# Altium schematic sheet Moo_AFE.SchDoc
size 317 x 215 mm; PageSetup: Record=PageOptions|CenterHorizontal=True|CenterVertical=True|PrintScale=0.57|XCorrection=0.00|YCorrection=1.00|PrintKind=2|BorderSize=5000000|LeftOffset=0|BottomOffset=0|Orientation=2|PaperLength=1000|PaperWidth=1000|Scale=100|PaperSource=15|PrintQuality=1200|MediaType=1|DitherType=10|PaperKind=Letter|PrintScaleMode=1
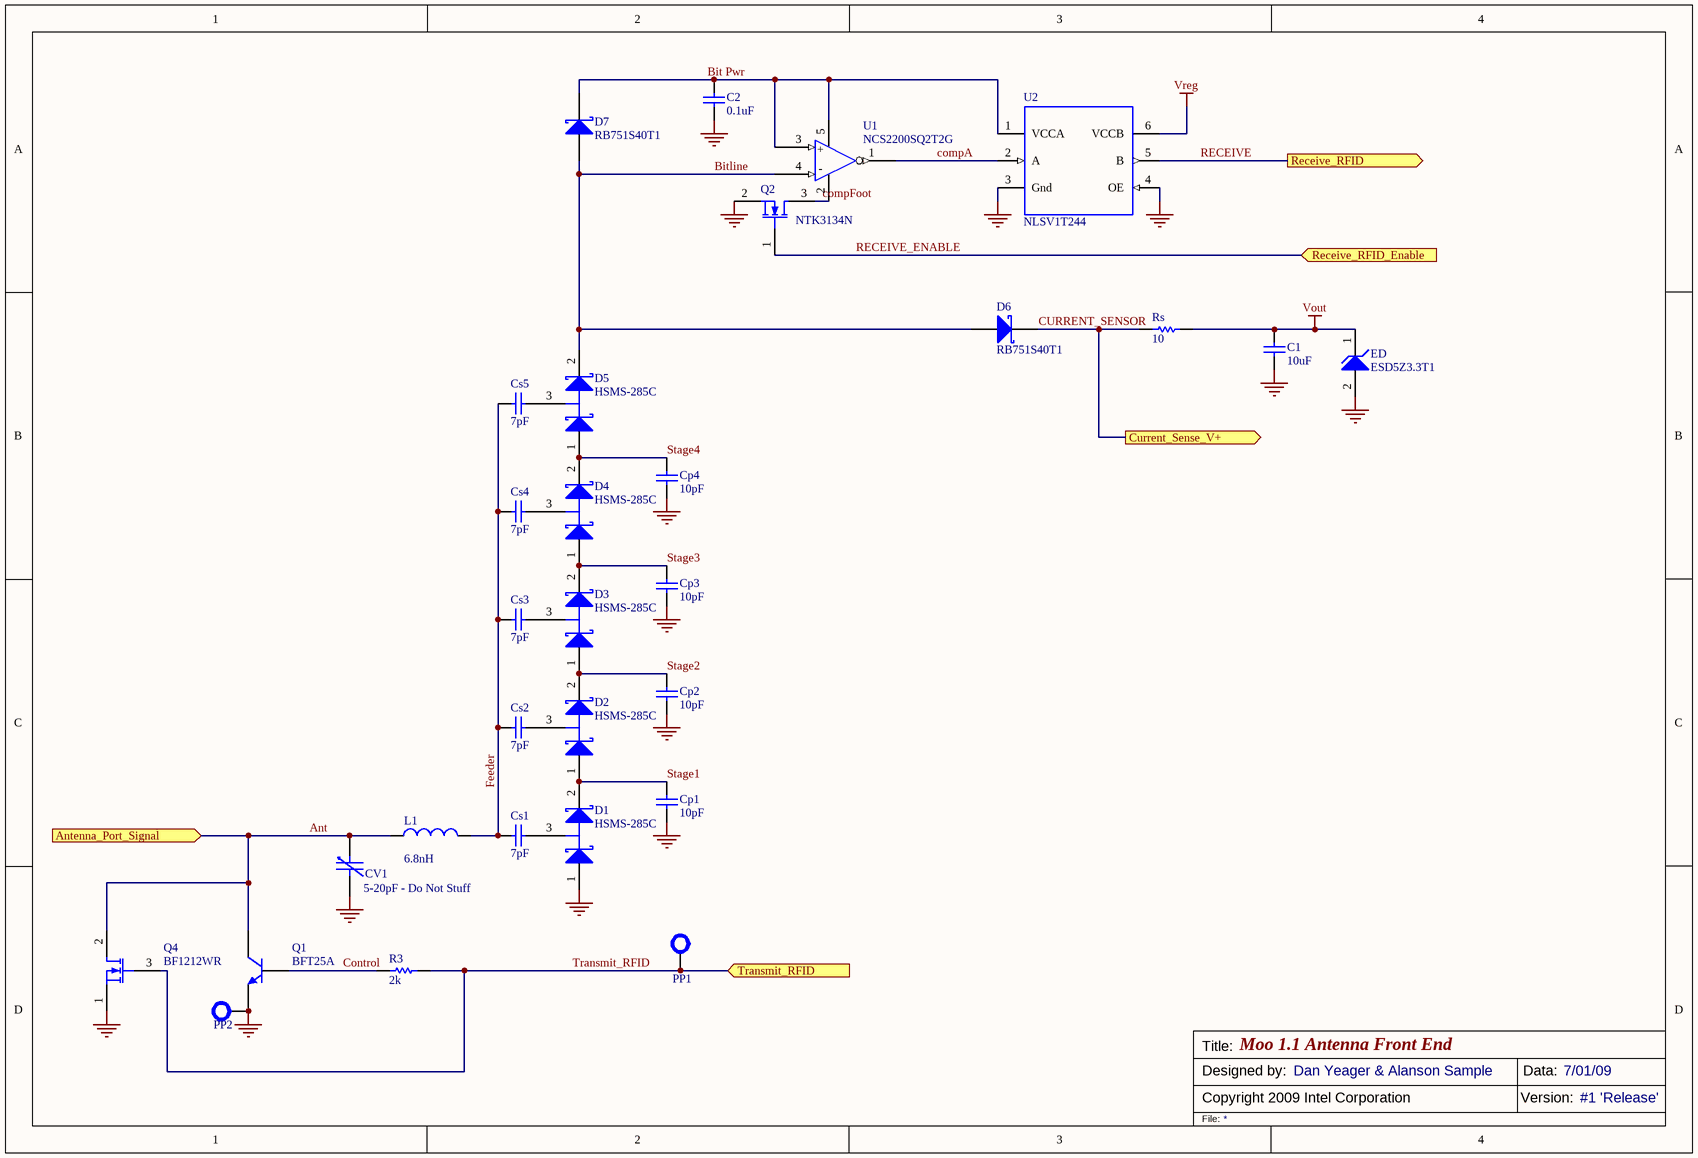
[diagram p0: Moo_AFE.SchDoc]

## Parts
C1  value 10uF  [0805]  (hidden comment: Ceramic_Chip_Capacitor)
C2  value 0.1uF  [0402]  (hidden comment: Ceramic_Chip_Capacitor)
Cp1  value 10pF  [0402]  (hidden comment: Ceramic_Chip_Capacitor)
Cp2  value 10pF  [0402]  (hidden comment: Ceramic_Chip_Capacitor)
Cp3  value 10pF  [0402]  (hidden comment: Ceramic_Chip_Capacitor)
Cp4  value 10pF  [0402]  (hidden comment: Ceramic_Chip_Capacitor)
Cs1  value 7pF  [0402]  (hidden comment: Ceramic_Chip_Capacitor)
Cs2  value 7pF  [0402]  (hidden comment: Ceramic_Chip_Capacitor)
Cs3  value 7pF  [0402]  (hidden comment: Ceramic_Chip_Capacitor)
Cs4  value 7pF  [0402]  (hidden comment: Ceramic_Chip_Capacitor)
Cs5  value 7pF  [0402]  (hidden comment: Ceramic_Chip_Capacitor)
CV1  value 5-20pF - Do Not Stuff  [Var-Cap_603]  (hidden comment: Var Cap)
D1  HSMS-285C  [SOT-323, HSMS-285C]
D2  HSMS-285C  [SOT-323, HSMS-285C]
D3  HSMS-285C  [SOT-323, HSMS-285C]
D4  HSMS-285C  [SOT-323, HSMS-285C]
D5  HSMS-285C  [SOT-323, HSMS-285C]
D6  RB751S40T1  [SOD-523]
D7  RB751S40T1  [SOD-523]
ED  ESD5Z3.3T1  [SOD-523]
L1  value 6.8nH  [0603]  (hidden comment: Inductor)
PP1  Probe Point  [Probe Point]  (value not drawn)
PP2  Probe Point  [Probe Point]  (value not drawn)
Q1  BFT25A  [SOT-23]
Q2  NTK3134N  [SOT723]
Q4  BF1212WR  [sot343r]
R3  value 2k  [0402]  (hidden comment: Thick Film Chip Resistor)
Rs  value 10  [0402]  (hidden comment: Thick Film Chip Resistor)
U1  NCS2200SQ2T2G  [sc70-5]
U2  NLSV1T244  [UDFN6]

## Ports
Antenna_Port_Signal (in), Current_Sense_V+ (out), Receive_RFID (out), Receive_RFID_Enable (in), Transmit_RFID (in)

## Nets
GND: C1.1 C2.2 Cp1.2 Cp2.2 Cp3.2 Cp4.2 CV1.2 D1.1(A) ED.2 PP2.0 Q1.2(E) Q2.2(S) Q4.1(S) U2.3(Gnd) U2.4(OE)
Vout: C1.2 ED.1 Rs.1
Vreg: U2.6(VCCB)
Ant: CV1.1 L1.1 Q1.3(C) Q4.2(D) ; port Antenna_Port_Signal
Bit Pwr: C2.1 D7.1(K) U1.3(IN+) U1.5(VDD) U2.1(VCCA)
Bitline: D5.2(K) D6.2(A) D7.2(A) U1.4(In-)
compA: U1.1(OUT) U2.2(A)
compFoot: Q2.3(D) U1.2(Gnd)
Control: Q1.1(B) R3.1
CURRENT_SENSOR: D6.1(C) Rs.2 ; port Current_Sense_V+
Feeder: Cs1.1 Cs2.1 Cs3.1 Cs4.1 Cs5.1 L1.2
RECEIVE: U2.5(B) ; port Receive_RFID
RECEIVE_ENABLE: Q2.1(G) ; port Receive_RFID_Enable
Stage1: Cp1.1 D1.2(K) D2.1(A)
Stage2: Cp2.1 D2.2(K) D3.1(A)
Stage3: Cp3.1 D3.2(K) D4.1(A)
Stage4: Cp4.1 D4.2(K) D5.1(A)
Transmit_RFID: PP1.0 Q4.3(G) R3.2 ; port Transmit_RFID
NetCs1_2: Cs1.2 D1.3(C)
NetCs2_2: Cs2.2 D2.3(C)
NetCs3_2: Cs3.2 D3.3(C)
NetCs4_2: Cs4.2 D4.3(C)
NetCs5_2: Cs5.2 D5.3(C)

## Notes on the sheet
- Title:
- Copyright 2009 Intel Corporation
- Designed by:
- Moo 1.1 Antenna Front End
- Dan Yeager & Alanson Sample
- Version:
- Data:
- 7/01/09
- #1 'Release'
- File:
- (in symbol NCS2200SQ2T2G) +; -

## Library data of the parts
C1 C2 Cp1-Cp4 Cs1-Cs5 = Ceramic_Chip_Capacitor: Ceramic Capacitor - Standard; Note: Footprint corresponds to dimensions for bulk cassette packaging. This case size has tightened tolerances.
CV1 = Var-Cap/603: Var-Cap 603 Compatible, DK: 490-2009 & SG2026CT; DNS: Do Not Stuff Part; Part Number: *; Digi-Key PN: 490-2009 & SG2026CT
D1-D5 = HSMS-285C: Agilent Schottky Diode, Bridge Quad, HSMS-285C; Note: *
D6 = RB751S40T1: Schottky Diode; Published: 8-Jun-2000; LatestRevisionDate: 17-Jul-2002; LatestRevisionNote: Re-released for DXP Platform.; PackageReference: SMB; Publisher: Altium Limited; Code_JEDEC: DO-214-AA
D7 = Schottky Diode: Published: 8-Jun-2000; LatestRevisionDate: 17-Jul-2002; LatestRevisionNote: Re-released for DXP Platform.; PackageReference: SMB; Publisher: Altium Limited; Code_JEDEC: DO-214-AA
ED = ESD5Z3.3T1: 5V Overvoltage Protection Zener
PP1 PP2 = Probe Point: Probe Point for debug
Q1 = BFT25A: NPN 5 GHz Wideband Transistor; DNS: Do Not Stuff Part; PackageReference: SOT23; Part Number: BFT25A
Q2 = NTK3134N: Powe Mosfet 20V, 890mA, Single N-channel
Q4 = BF1212
R3 Rs = Thick Film Chip Resistor: Note: Do Note Stuff
U1 = NCS2200SQ2T2G: On Semi 10uA Comparator
U2 = NLSV1T244: Level Shifter: 1-Bit Dual-Supply Non-Inverting Level Translator; Part Number: ADG3301; DNS: Do Not Stuff Part
L1 = Inductor: Code_JEITA: 0805; Code_IPC: 2012[0805]